# Altium project TE0722.PrjPcb
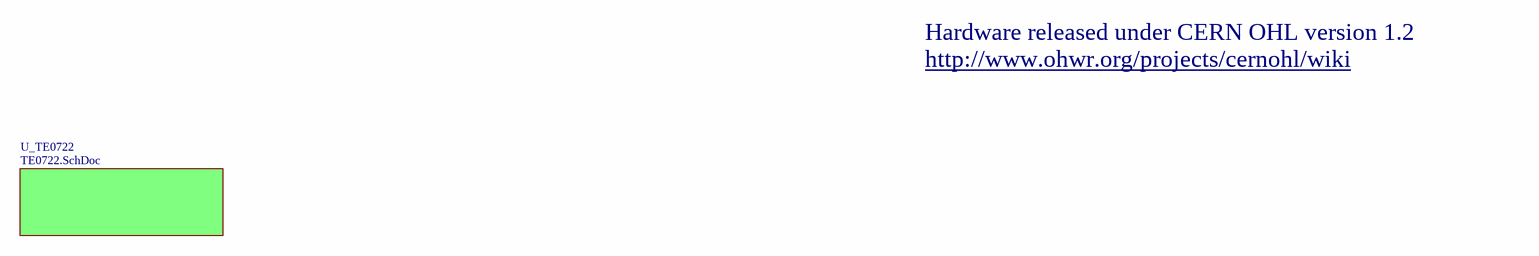
[diagram p0: SoftPropeller_V1_40P14.SchDoc]
7 sheets, 69 parts. Net scope: global (net labels, ports and power ports of the same name join across sheets).
Board file: TE0722.Pcbdoc
Sheets:
  SoftPropeller_V1_40P14.SchDoc
    U_TE0722 = TE0722.SchDoc
      U_POWER = POWER.SchDoc
      U_FPGA_B34 = FPGA_B34.SchDoc
      U_FPGA_B35 = FPGA_B35.SchDoc
      U_FPGA_MIO = FPGA_MIO.SchDoc
      U_FPGA_PWR = FPGA_PWR.SchDoc

## Sheet SoftPropeller_V1_40P14.SchDoc: TE0722
size A4; Organization: Trenz Electronic GmbH; DocumentNumber: 7; Revision: 01; SheetNumber: 7; SheetTotal: 8; Date: 07.11.2014

### Sub-sheets
U_TE0722 = TE0722.SchDoc: no entries

### Notes on the sheet
- Hardware released under CERN OHL version 1.2
- http://www.ohwr.org/projects/cernohl/wiki
- Title:
- Number:
- Rev.
- Date:
- A4
- Copyright:
- Page
- of
- Filename:

## Sheet TE0722.SchDoc: TE0722
size A4; Organization: Trenz Electronic GmbH; DocumentNumber: 8; Revision: 01; SheetNumber: 8; SheetTotal: 8; Date: 07.11.2014
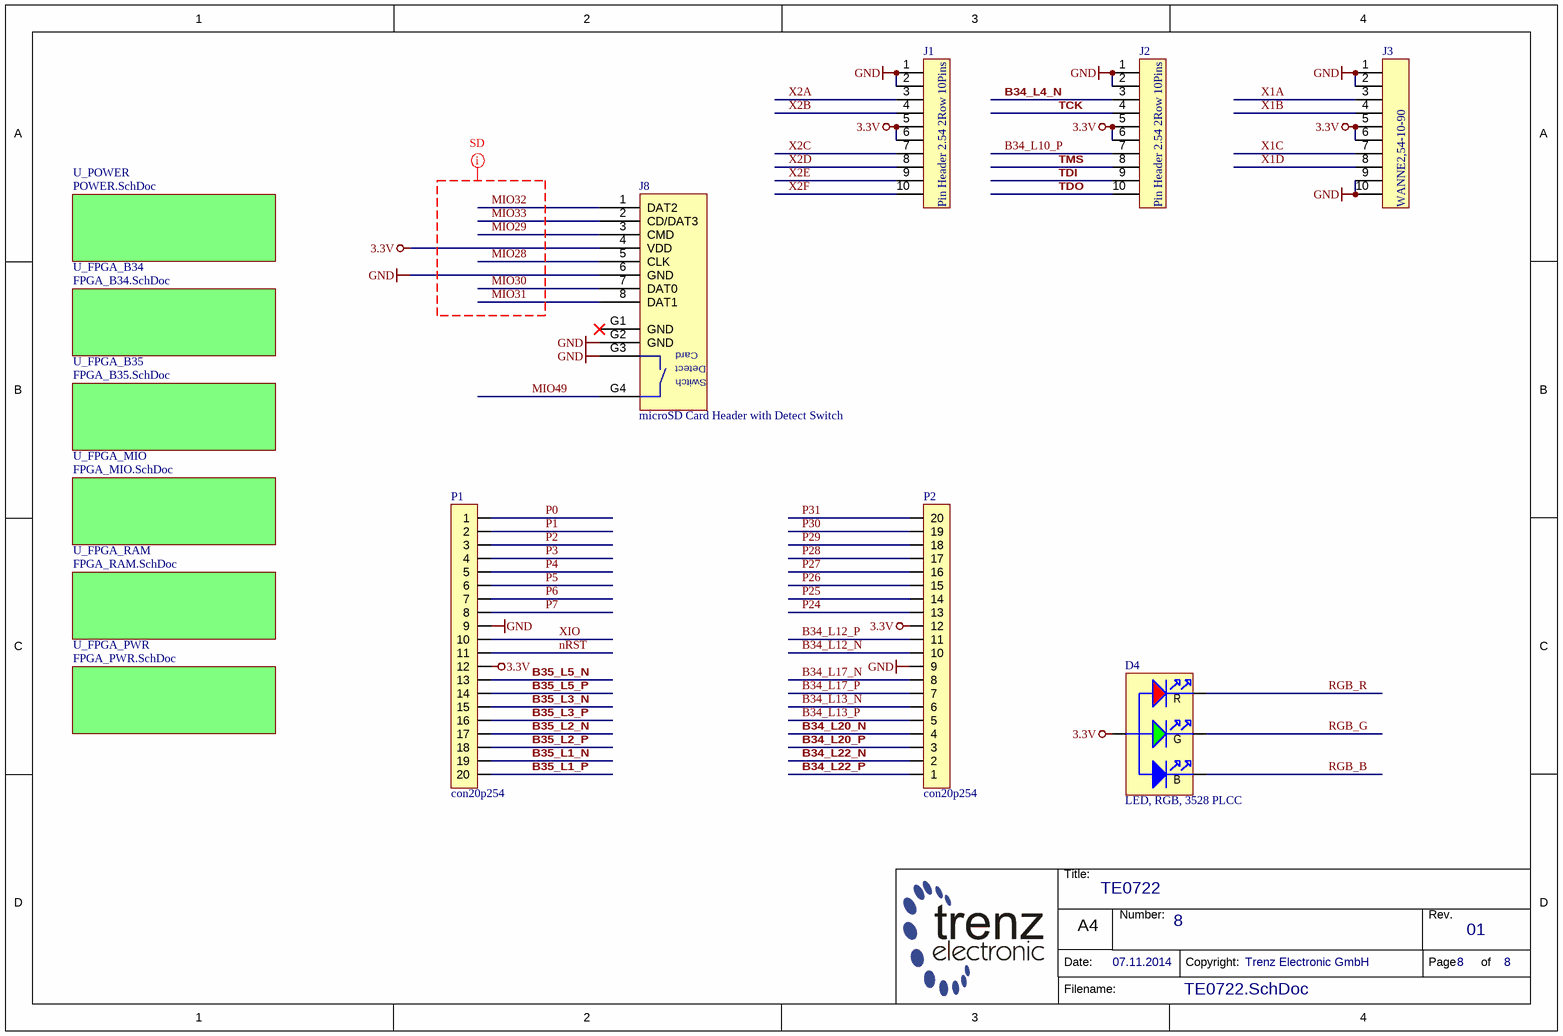
[diagram p1: TE0722.SchDoc]

### Parts
D4  LED, RGB, 3528 PLCC  [PLCC150P360X280X190-4N]
J1  Pin Header 2.54 2Row 10Pins  [STIFTLEISTE2_54 OG 2R-10]
J2  Pin Header 2.54 2Row 10Pins  [STIFTLEISTE2_54 OG 2R-10]
J3  WANNE2,54-10-90  [WANNE2,54-10-90]
J8  microSD Card Header with Detect Switch  [47309-2651]
P1  value con20p254  [con_20p254]  (hidden comment: con_20pin)
P2  value con20p254  [con_20p254]  (hidden comment: con_20pin)

### Sub-sheets
U_FPGA_B34 = FPGA_B34.SchDoc: no entries
U_FPGA_B35 = FPGA_B35.SchDoc: no entries
U_FPGA_MIO = FPGA_MIO.SchDoc: no entries
U_FPGA_PWR = FPGA_PWR.SchDoc: no entries
U_FPGA_RAM = FPGA_RAM.SchDoc (file not in this document): no entries
U_POWER = POWER.SchDoc: no entries

### Nets
3.3V: D4.3(ANODE) J1.5 J1.6 J2.5 J2.6 J3.5 J3.6 J8.4(VDD) P1.12 P2.12
GND: J1.1 J1.2 J2.1 J2.2 J3.1 J3.2 J3.9 J3.10 J8.6(GND) J8.G2(GND) J8.G3(POL) P1.9 P2.9
B34_L4_N: J2.3
B34_L10_P: J2.7
B34_L12_N: P2.10
B34_L12_P: P2.11
B34_L13_N: P2.6
B34_L13_P: P2.5
B34_L17_N: P2.8
B34_L17_P: P2.7
B34_L20_N: P2.4
B34_L20_P: P2.3
B34_L22_N: P2.2
B34_L22_P: P2.1
B35_L1_N: P1.19
B35_L1_P: P1.20
B35_L2_N: P1.17
B35_L2_P: P1.18
B35_L3_N: P1.15
B35_L3_P: P1.16
B35_L5_N: P1.13
B35_L5_P: P1.14
MIO28: J8.5(CLK)
MIO29: J8.3(CMD)
MIO30: J8.7(DAT0)
MIO31: J8.8(DAT1)
MIO32: J8.1(DAT2)
MIO33: J8.2(CD/DAT3)
MIO49: J8.G4(DET)
nRST: P1.11
P0: P1.1
P1: P1.2
P2: P1.3
P3: P1.4
P4: P1.5
P5: P1.6
P6: P1.7
P7: P1.8
P24: P2.13
P25: P2.14
P26: P2.15
P27: P2.16
P28: P2.17
P29: P2.18
P30: P2.19
P31: P2.20
RGB_B: D4.4(BLUE)
RGB_G: D4.2(GREEN)
RGB_R: D4.1(RED)
TCK: J2.4
TDI: J2.9
TDO: J2.10
TMS: J2.8
X1A: J3.3
X1B: J3.4
X1C: J3.7
X1D: J3.8
X2A: J1.3
X2B: J1.4
X2C: J1.7
X2D: J1.8
X2E: J1.9
X2F: J1.10
XIO: P1.10

Not connected (* = marked no-connect by the designer): J8 G1(GND)*

### Layout directives
net class SD: MIO28, MIO29, MIO30, MIO31, MIO32, MIO33

### Notes on the sheet
- Title:
- Number:
- Rev.
- Date:
- A4
- Copyright:
- Page
- of
- Filename:
- (in symbol 24994) Card; Detect; Switch
- (in symbol 26299) R; G; B

### Library data of the parts
D4 = 26299: AN: 26299; Mixed: SMT; Case: 3528 PLCC; HelpURL: B:\AD\adlib\datasheet\Multicomp-LED-RGB-PLCC
J1 J2 = 22402: Stiftleiste gerade 2-reihig, 10pol.; AN: 22402; Mixed: THT; Trenz-Stock: Yes
J3 = 20605: Stiftleiste Wanne 10polig 90°; AN: 20605; Mixed: THT; Trenz-Stock: Yes
J8 = 24994: AN: 24994; Mixed: SMT; Trenz-Stock: Yes; Case: microSD; HelpURL: B:\AD\adlib\datasheet\47309-2651; Preferred: Yes
P1 P2 = con20p254: con_20pin_254_1row; ID: 40; Component: con20p254

## Sheet POWER.SchDoc: TE0722
size A; Date: 07.11.2014; Organization: Trenz Electronic GmbH; DocumentNumber: 1; Revision: 01; SheetNumber: 1; SheetTotal: 8
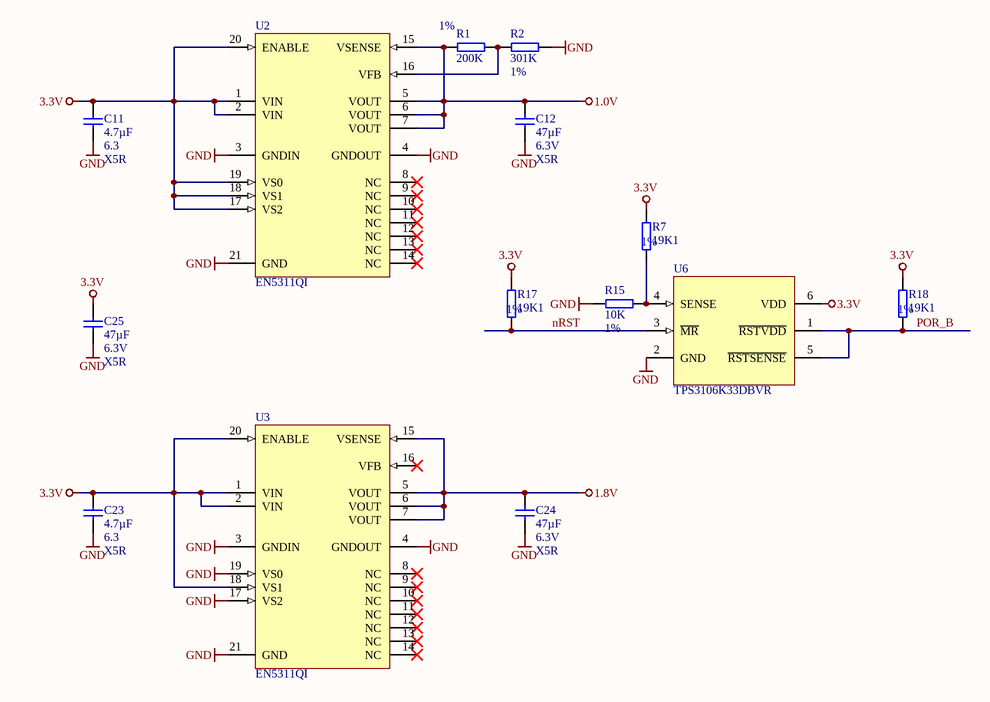
[diagram p2: POWER.SchDoc]

### Parts
C11  4.7µF  Voltage: 6.3  Technology: X5R  [CAPC1005X60N]
C12  47µF  Voltage: 6.3V  Technology: X5R  [CAPC2012X135N]
C23  4.7µF  Voltage: 6.3  Technology: X5R  [CAPC1005X60N]
C24  47µF  Voltage: 6.3V  Technology: X5R  [CAPC2012X135N]
C25  47µF  Voltage: 6.3V  Technology: X5R  [CAPC2012X135N]
R1  200K  Tolerance: 1%  [RESC1005X40N]
R2  301K  Tolerance: 1%  [RESC1005X40N]
R7  19K1  Tolerance: 1%  [RESC0603X26N]
R15  10K  Tolerance: 1%  [RESC0603X26N]
R17  19K1  Tolerance: 1%  [RESC0603X26N]
R18  19K1  Tolerance: 1%  [RESC0603X26N]
U2  EN5311QI  [EN5311QI]
U3  EN5311QI  [EN5311QI]
U6  TPS3106K33DBVR  [SOT95P280X145-6N]

### Nets
1.0V: C12.1 R1.1 U2.5(VOUT) U2.6(VOUT) U2.7(VOUT) U2.15(VSENSE)
1.8V: C24.1 U3.5(VOUT) U3.6(VOUT) U3.7(VOUT) U3.15(VSENSE)
3.3V: C11.1 C23.1 C25.1 R7.2 R17.2 R18.2 U2.1(VIN) U2.2(VIN) U2.17(VS2) U2.18(VS1) U2.19(VS0) U2.20(ENABLE) U3.1(VIN) U3.2(VIN) U3.18(VS1) U3.20(ENABLE) U6.6(VDD)
GND: C11.2 C12.2 C23.2 C24.2 C25.2 R2.2 R15.1 U2.3(GNDIN) U2.4(GNDOUT) U2.21(GND) U3.3(GNDIN) U3.4(GNDOUT) U3.17(VS2) U3.19(VS0) U3.21(GND) U6.2(GND)
nRST: R17.1 U6.3(~{MR})
POR_B: R18.1 U6.1(~{RSTVDD}) U6.5(~{RSTSENSE})
NetR1_2: R1.2 R2.1 U2.16(VFB)
NetR7_1: R7.1 R15.2 U6.4(SENSE)

Not connected (* = marked no-connect by the designer): U2 8(NC)* 9(NC)* 10(NC)* 11(NC)* 12(NC)* 13(NC)* 14(NC)*; U3 8(NC)* 9(NC)* 10(NC)* 11(NC)* 12(NC)* 13(NC)* 14(NC)* 16(VFB)*

### Library data of the parts
C11 C23 = 24719: KON 4.7µF 6.3V X5R SMD 20%; AN: 24719; Mixed: SMT; Value: 4.7u; Preferred: Yes; Case: 1005 (0402); Tolerance: 20%
C12 C24 C25 = 24718: KON 47µF 6,3V  X5R SMD 20%; AN: 24718; Mixed: SMT; Value: 47u; Preferred: Yes; Case: 2012 (0805); Tolerance: 20%
R1 = 23846: WID SMD 200K 1% 0,063W; AN: 23846; Mixed: SMT; Preferred: Yes; Case: 1005 (0402); Value: 200K
R2 = 26224: WID SMD 301K 1% 0,063W; AN: 26224; Mixed: SMT; Case: 1005 (0402); Value: 301k
R7 R17 R18 = 25053: WID SMD 19K1 1% 0,05W; AN: 25053; Mixed: SMT; Value: 19.1K; Case: 0603 (0201); HelpURL: B:\AD\adlib\datasheet\R0201
R15 = 24914: WID SMD 10K 1% 0,05W; AN: 24914; Mixed: SMT; Preferred: Yes; Case: 0603 (0201); Value: 10K; HelpURL: B:\AD\adlib\datasheet\R0201
U2 U3 = 25492: AN: 25492; Mixed: SMT; Trenz-Stock: Yes; Case: QFN20; HelpURL: B:\AD\adlib\datasheet\EN5311QI; Preferred: Yes
U6 = 26439: AN: 26439; Mixed: SMT; Case: SOT23-6; HelpURL: B:\ad\adlib\datasheet\TPS3106

## Sheet FPGA_B34.SchDoc: TE0722
size A4; Organization: Trenz Electronic GmbH; DocumentNumber: 2; Revision: 01; SheetNumber: 2; SheetTotal: 8; Date: 07.11.2014; PageSetup: Record=PageOptions|CenterHorizontal=True|CenterVertical=True|PrintScale=0.96|XCorrection=1.00|YCorrection=1.00|PrintKind=0|BorderSize=5000000|LeftOffset=0|BottomOffset=0|Orientation=2|PaperLength=1000|PaperWidth=1000|Scale=100|PaperSource=7|PrintQuality=-4|MediaType=1|DitherType=10|PaperKind=A4|PrintScaleMode=1
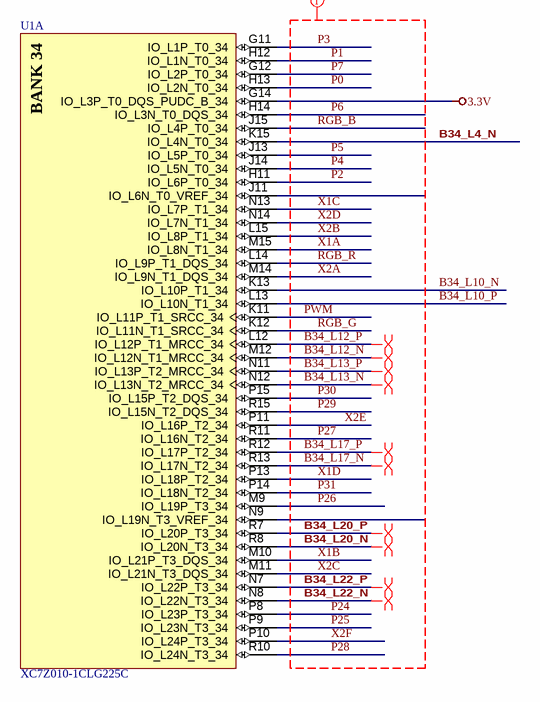
[diagram p3: FPGA_B34.SchDoc]

### Parts
U1  XC7Z010-1CLG225C  [CLG225]  (part A of 8)

### Nets
3.3V: U1.G14(IO_L3P_T0_DQS_PUDC_B_34)
B34_L4_N: U1.K15(IO_L4N_T0_34)
B34_L10_N: U1.K13(IO_L10P_T1_34)
B34_L10_P: U1.L13(IO_L10N_T1_34)
B34_L12_N: U1.M12(IO_L12N_T1_MRCC_34)
B34_L12_P: U1.L12(IO_L12P_T1_MRCC_34)
B34_L13_N: U1.N12(IO_L13N_T2_MRCC_34)
B34_L13_P: U1.N11(IO_L13P_T2_MRCC_34)
B34_L17_N: U1.R13(IO_L17N_T2_34)
B34_L17_P: U1.R12(IO_L17P_T2_34)
B34_L20_N: U1.R8(IO_L20N_T3_34)
B34_L20_P: U1.R7(IO_L20P_T3_34)
B34_L22_N: U1.N8(IO_L22N_T3_34)
B34_L22_P: U1.N7(IO_L22P_T3_34)
P0: U1.H13(IO_L2N_T0_34)
P1: U1.H12(IO_L1N_T0_34)
P2: U1.H11(IO_L6P_T0_34)
P3: U1.G11(IO_L1P_T0_34)
P4: U1.J14(IO_L5N_T0_34)
P5: U1.J13(IO_L5P_T0_34)
P6: U1.H14(IO_L3N_T0_DQS_34)
P7: U1.G12(IO_L2P_T0_34)
P24: U1.P8(IO_L23P_T3_34)
P25: U1.P9(IO_L23N_T3_34)
P26: U1.M9(IO_L19P_T3_34)
P27: U1.R11(IO_L16N_T2_34)
P28: U1.R10(IO_L24N_T3_34)
P29: U1.R15(IO_L15N_T2_DQS_34)
P30: U1.P15(IO_L15P_T2_DQS_34)
P31: U1.P14(IO_L18N_T2_34)
PWM: U1.K11(IO_L11P_T1_SRCC_34)
RGB_B: U1.J15(IO_L4P_T0_34)
RGB_G: U1.K12(IO_L11N_T1_SRCC_34)
RGB_R: U1.L14(IO_L9P_T1_DQS_34)
X1A: U1.M15(IO_L8N_T1_34)
X1B: U1.M10(IO_L21P_T3_DQS_34)
X1C: U1.N13(IO_L7P_T1_34)
X1D: U1.P13(IO_L18P_T2_34)
X2A: U1.M14(IO_L9N_T1_DQS_34)
X2B: U1.L15(IO_L8P_T1_34)
X2C: U1.M11(IO_L21N_T3_DQS_34)
X2D: U1.N14(IO_L7N_T1_34)
X2E: U1.P11(IO_L16P_T2_34)
X2F: U1.P10(IO_L24P_T3_34)

Not connected (* = marked no-connect by the designer): U1 J11(IO_L6N_T0_VREF_34) N9(IO_L19N_T3_VREF_34)

### Layout directives
net class B34: B34_L12_N, B34_L12_P, B34_L13_N, B34_L13_P, B34_L17_N, B34_L17_P, B34_L20_N, B34_L20_P, B34_L22_N, B34_L22_P, P0, P1, P2, P3, P4, P5, P6, P7, P24, P25, P26, P27, P28, P29, P30, P31, PWM, RGB_B, RGB_G, RGB_R, X1A, X1B, X1C, X1D, X2A, X2B, X2C, X2D, X2E, X2F
differential pair: B34_L12_N, B34_L12_P, B34_L13_N, B34_L13_P, B34_L17_N, B34_L17_P, B34_L20_N, B34_L20_P, B34_L22_N, B34_L22_P

### Notes on the sheet
- Title:
- Nummer:
- Rev.
- Datum:
- A4
- Zeichner:
- Blatt
- von
- Filename:
- (in symbol 26308, part A) BANK 34

### Library data of the parts
U1 = 26308: AN: 26308; Mixed: SMT; Case: CLG225; HelpURL: B:\AD\adlib\datasheet\XC7\Zynq

## Sheet FPGA_B35.SchDoc: TE0722
size A4; Organization: Trenz Electronic GmbH; DocumentNumber: 3; Revision: 01; SheetNumber: 3; SheetTotal: 8; Date: 07.11.2014; PageSetup: Record=PageOptions|CenterHorizontal=True|CenterVertical=True|PrintScale=0.96|XCorrection=1.00|YCorrection=1.00|PrintKind=0|BorderSize=5000000|LeftOffset=0|BottomOffset=0|Orientation=2|PaperLength=1000|PaperWidth=1000|Scale=100|PaperSource=7|PrintQuality=-4|MediaType=1|DitherType=10|PaperKind=A4|PrintScaleMode=1
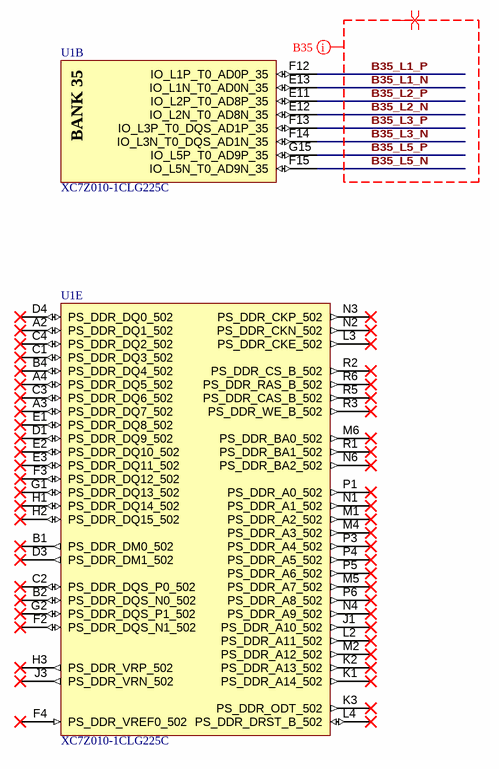
[diagram p4: FPGA_B35.SchDoc]

### Parts
U1  XC7Z010-1CLG225C  [CLG225]  (parts B,E of 8)

### Nets
B35_L1_N: U1.E13(IO_L1N_T0_AD0N_35)
B35_L1_P: U1.F12(IO_L1P_T0_AD0P_35)
B35_L2_N: U1.E12(IO_L2N_T0_AD8N_35)
B35_L2_P: U1.E11(IO_L2P_T0_AD8P_35)
B35_L3_N: U1.F14(IO_L3N_T0_DQS_AD1N_35)
B35_L3_P: U1.F13(IO_L3P_T0_DQS_AD1P_35)
B35_L5_N: U1.F15(IO_L5N_T0_AD9N_35)
B35_L5_P: U1.G15(IO_L5P_T0_AD9P_35)

Not connected (* = marked no-connect by the designer): U1 A2(PS_DDR_DQ1_502)* A3(PS_DDR_DQ7_502)* A4(PS_DDR_DQ5_502)* B1(PS_DDR_DM0_502)* B2(PS_DDR_DQS_N0_502)* B4(PS_DDR_DQ4_502)* C1(PS_DDR_DQ3_502)* C2(PS_DDR_DQS_P0_502)* C3(PS_DDR_DQ6_502)* C4(PS_DDR_DQ2_502)* D1(PS_DDR_DQ9_502)* D3(PS_DDR_DM1_502)* D4(PS_DDR_DQ0_502)* E1(PS_DDR_DQ8_502)* E2(PS_DDR_DQ10_502)* E3(PS_DDR_DQ11_502)* F2(PS_DDR_DQS_N1_502)* F3(PS_DDR_DQ12_502)* F4(PS_DDR_VREF0_502)* G1(PS_DDR_DQ13_502)* G2(PS_DDR_DQS_P1_502)* H1(PS_DDR_DQ14_502)* H2(PS_DDR_DQ15_502)* H3(PS_DDR_VRP_502)* J1(PS_DDR_A10_502)* J3(PS_DDR_VRN_502)* K1(PS_DDR_A14_502)* K2(PS_DDR_A13_502)* K3(PS_DDR_ODT_502)* L2(PS_DDR_A11_502)* L3(PS_DDR_CKE_502)* L4(PS_DDR_DRST_B_502)* M1(PS_DDR_A2_502)* M2(PS_DDR_A12_502)* M4(PS_DDR_A3_502)* M5(PS_DDR_A7_502)* M6(PS_DDR_BA0_502)* N1(PS_DDR_A1_502)* N2(PS_DDR_CKN_502)* N3(PS_DDR_CKP_502)* N4(PS_DDR_A9_502)* N6(PS_DDR_BA2_502)* P1(PS_DDR_A0_502)* P3(PS_DDR_A4_502)* P4(PS_DDR_A5_502)* P5(PS_DDR_A6_502)* P6(PS_DDR_A8_502)* R1(PS_DDR_BA1_502)* R2(PS_DDR_CS_B_502)* R3(PS_DDR_WE_B_502)* R5(PS_DDR_CAS_B_502)* R6(PS_DDR_RAS_B_502)*

### Layout directives
net class B35: B35_L1_N, B35_L1_P, B35_L2_N, B35_L2_P, B35_L3_N, B35_L3_P, B35_L5_N, B35_L5_P
differential pair: B35_L1_N, B35_L1_P, B35_L2_N, B35_L2_P, B35_L3_N, B35_L3_P, B35_L5_N, B35_L5_P

### Notes on the sheet
- Title:
- Nummer:
- Rev.
- Datum:
- A4
- Zeichner:
- Blatt
- von
- Filename:
- (in symbol 26308, part B) BANK 35

### Library data of the parts
U1 = 26308: AN: 26308; Mixed: SMT; Case: CLG225; HelpURL: B:\AD\adlib\datasheet\XC7\Zynq

## Sheet FPGA_MIO.SchDoc: TE0722
size A4; Organization: Trenz Electronic GmbH; DocumentNumber: 4; Revision: 01; SheetNumber: 4; SheetTotal: 8; Date: 07.11.2014; PageSetup: Record=PageOptions|CenterHorizontal=True|CenterVertical=True|PrintScale=0.96|XCorrection=1.00|YCorrection=1.00|PrintKind=0|BorderSize=5000000|LeftOffset=0|BottomOffset=0|Orientation=2|PaperLength=1000|PaperWidth=1000|Scale=100|PaperSource=7|PrintQuality=-4|MediaType=1|DitherType=10|PaperKind=A4|PrintScaleMode=1
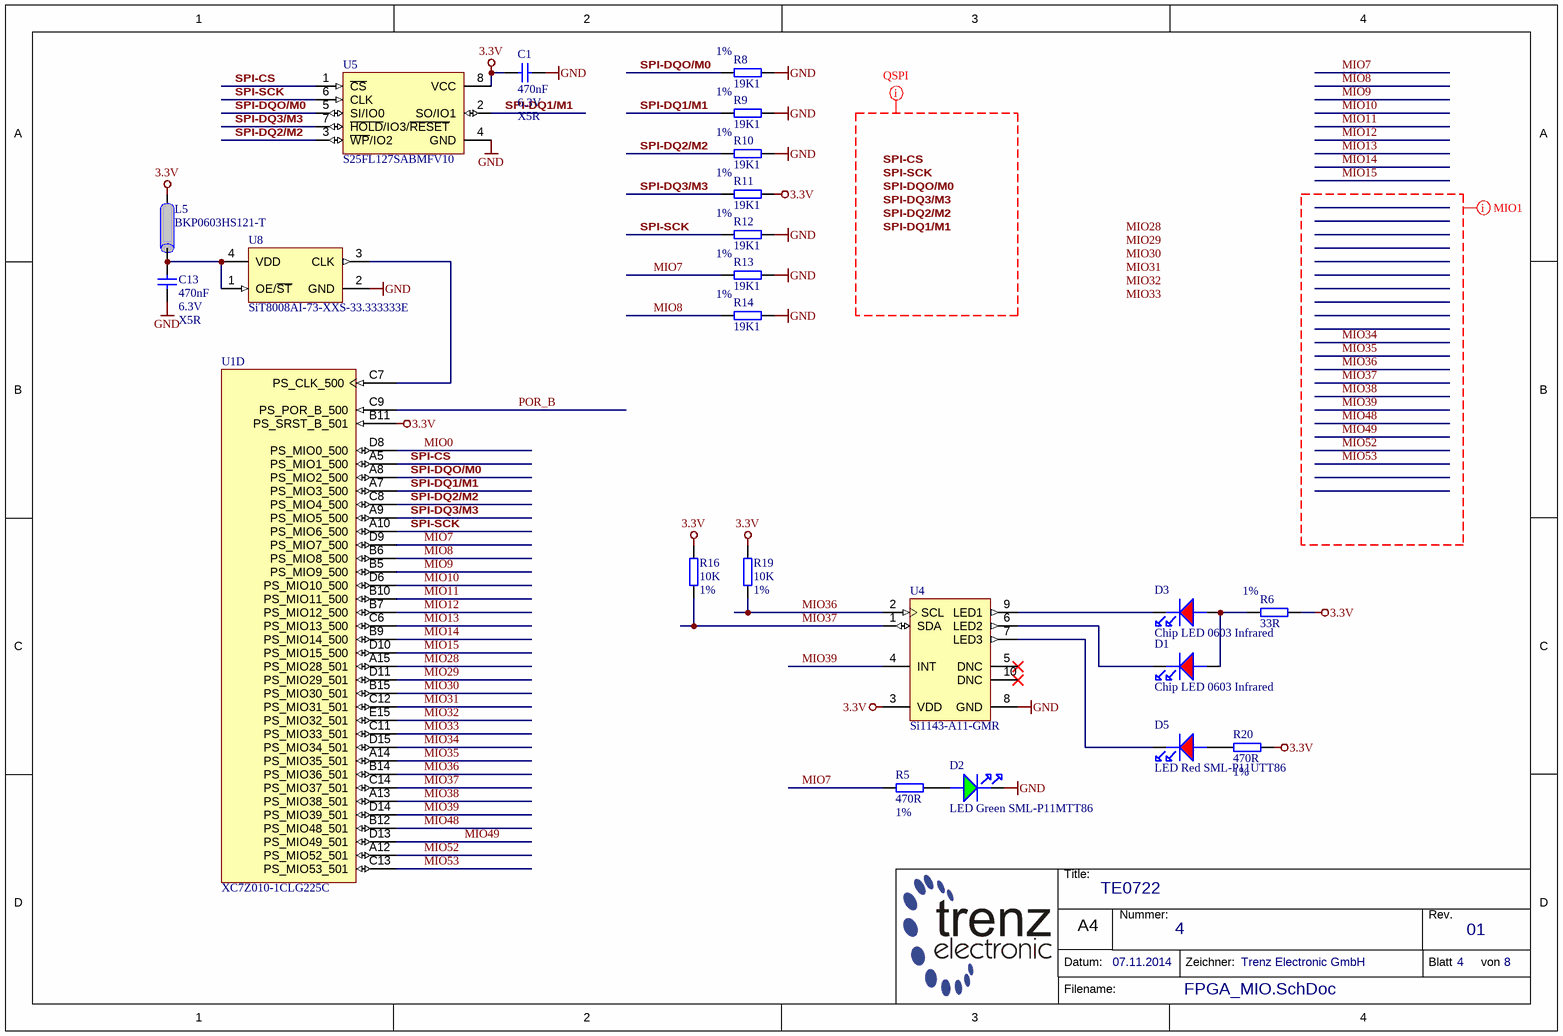
[diagram p5: FPGA_MIO.SchDoc]

### Parts
C1  470nF  Voltage: 6.3V  Technology: X5R  [CAPC0603X33N]
C13  470nF  Voltage: 6.3V  Technology: X5R  [CAPC0603X33N]
D1  Chip LED 0603 Infrared  [chipLED_0603_Red]
D2  LED Green SML-P11MTT86  [LEDC1006X25N_GREEN]
D3  Chip LED 0603 Infrared  [chipLED_0603_Red]
D5  LED Red SML-P11UTT86  [LEDC1006X25N_RED]
L5  BKP0603HS121-T  [INDC0603X33N]
R5  470R  Tolerance: 1%  [RESC1005X40N]
R6  33R  Tolerance: 1%  [RESC1005X40N]
R8  19K1  Tolerance: 1%  [RESC0603X26N]
R9  19K1  Tolerance: 1%  [RESC0603X26N]
R10  19K1  Tolerance: 1%  [RESC0603X26N]
R11  19K1  Tolerance: 1%  [RESC0603X26N]
R12  19K1  Tolerance: 1%  [RESC0603X26N]
R13  19K1  Tolerance: 1%  [RESC0603X26N]
R14  19K1  Tolerance: 1%  [RESC0603X26N]
R16  10K  Tolerance: 1%  [RESC0603X26N]
R19  10K  Tolerance: 1%  [RESC0603X26N]
R20  470R  Tolerance: 1%  [RESC1005X40N]
U1  XC7Z010-1CLG225C  [CLG225]  (part D of 8)
U4  Si1143-A11-GMR  [QFN50P200X200X75-10N]
U5  S25FL127SABMFV10  [SOIC127P790X216-8N]
U8  SiT8008AI-73-XXS-33.333333E  [2016]

### Nets
3.3V: C1.1 L5.1 R6.2 R11.2 R16.2 R19.2 R20.1 U1.B11(PS_SRST_B_501) U4.3(VDD) U5.8(VCC)
GND: C1.2 C13.2 D2.K R8.2 R9.2 R10.2 R12.2 R13.2 R14.2 U4.8(GND) U5.4(GND) U8.2(GND)
MIO0: U1.D8(PS_MIO0_500)
MIO7: R5.2 R13.1 U1.D9(PS_MIO7_500)
MIO8: R14.1 U1.B6(PS_MIO8_500)
MIO9: U1.B5(PS_MIO9_500)
MIO10: U1.D6(PS_MIO10_500)
MIO11: U1.B10(PS_MIO11_500)
MIO12: U1.B7(PS_MIO12_500)
MIO13: U1.C6(PS_MIO13_500)
MIO14: U1.B9(PS_MIO14_500)
MIO15: U1.D10(PS_MIO15_500)
MIO28: U1.A15(PS_MIO28_501)
MIO29: U1.D11(PS_MIO29_501)
MIO30: U1.B15(PS_MIO30_501)
MIO31: U1.C12(PS_MIO31_501)
MIO32: U1.E15(PS_MIO32_501)
MIO33: U1.C11(PS_MIO33_501)
MIO34: U1.D15(PS_MIO34_501)
MIO35: U1.A14(PS_MIO35_501)
MIO36: R19.1 U1.B14(PS_MIO36_501) U4.2(SCL)
MIO37: R16.1 U1.C14(PS_MIO37_501) U4.1(SDA)
MIO38: U1.A13(PS_MIO38_501)
MIO39: U1.D14(PS_MIO39_501) U4.4(INT)
MIO48: U1.B12(PS_MIO48_501)
MIO49: U1.D13(PS_MIO49_501)
MIO52: U1.A12(PS_MIO52_501)
MIO53: U1.C13(PS_MIO53_501)
POR_B: U1.C9(PS_POR_B_500)
SPI-CS: U1.A5(PS_MIO1_500) U5.1(~{CS})
SPI-DQ1/M1: R9.1 U1.A7(PS_MIO3_500) U5.2(SO/IO1)
SPI-DQ2/M2: R10.1 U1.C8(PS_MIO4_500) U5.3(~{WP}/IO2)
SPI-DQ3/M3: R11.1 U1.A9(PS_MIO5_500) U5.7(~{HOLD}/IO3/~{RESET})
SPI-DQO/M0: R8.1 U1.A8(PS_MIO2_500) U5.5(SI/IO0)
SPI-SCK: R12.1 U1.A10(PS_MIO6_500) U5.6(CLK)
NetC13_1: C13.1 L5.2 U8.1(OE/~{ST}) U8.4(VDD)
NetD1_A: D1.A D3.A R6.1
NetD1_K: D1.K U4.6(LED2)
NetD2_A: D2.A R5.1
NetD3_K: D3.K U4.9(LED1)
NetD5_A: D5.A R20.2
NetD5_K: D5.K U4.7(LED3)
NetU1_C7: U1.C7(PS_CLK_500) U8.3(CLK)

Not connected (* = marked no-connect by the designer): U4 5(DNC)* 10(DNC)*

### Layout directives
net class MIO1: MIO34, MIO35, MIO36, MIO37, MIO38, MIO39, MIO48, MIO49, MIO52, MIO53
net class QSPI: SPI-CS, SPI-DQ1/M1, SPI-DQ2/M2, SPI-DQ3/M3, SPI-DQO/M0, SPI-SCK

### Notes on the sheet
- Labels drawn without touching a wire or pin: MIO28, MIO29, MIO30, MIO31, MIO32, MIO33, SPI-CS, SPI-DQ1/M1, SPI-DQ2/M2, SPI-DQ3/M3, SPI-DQO/M0, SPI-SCK
- Title:
- Nummer:
- Rev.
- Datum:
- A4
- Zeichner:
- Blatt
- von
- Filename:

### Library data of the parts
C1 C13 = 24921: KON 470nF X5R 6.3V SMD 20%; AN: 24921; Value: 470n; Mixed: SMT; Preferred: Yes; Case: 0603 (0201); Tolerance: 20%
D1 D3 = 26721: AN: 26721; Voltage: 1.2; Mixed: SMT; Preferred: Yes; Case: 0603; HelpURL: B:\AD\adlib\datasheet\APT1608F3C
D2 = 24211: LED Grün SML-P11MTT86 SMD; AN: 24211; Mixed: SMT; Preferred: Yes; Case: 1005 (0402); HelpURL: B:\AD\adlib\datasheet\SML-P1
D5 = 24212: LED Rot SML-P11UTT86 SMD; AN: 24212; Mixed: SMT; Preferred: Yes; Case: 1005 (0402); HelpURL: B:\AD\adlib\datasheet\SML-P1
L5 = 25393: Ferritdurchführung SMD 0201; AN: 25393; Trenz-Stock: Yes; Mixed: SMT; Tolerance: 25%; Case: 0603 (0201); HelpURL: B:\AD\adlib\datasheet\MULTILAYER CHIP BEAD INDUCTORS BK; Preferred: Yes
R5 R20 = 22769: WID SMD 470R 1% 0,063W; AN: 22769; Value: 470; Mixed: SMT; Preferred: Yes; Case: 1005 (0402)
R6 = 22770: WID SMD 33R 1% 0,063W; AN: 22770; Mixed: SMT; Value: 33; Preferred: Yes; Case: 1005 (0402)
R8-R14 = 25053: as R7 on sheet POWER; Case: 0603 (0201); HelpURL: B:\AD\adlib\datasheet\R0201
R16 R19 = 24914: as R15 on sheet POWER; Case: 0603 (0201); Value: 10K; HelpURL: B:\AD\adlib\datasheet\R0201
U1 = 26308: AN: 26308; Mixed: SMT; Case: CLG225; HelpURL: B:\AD\adlib\datasheet\XC7\Zynq
U4 = 26318: AN: 26318; Mixed: AMT; Case: QFN10; HelpURL: B:\AD\adlib\datasheet\Si1141x
U5 = 26078: S25FL127SABMFV10 automotive SO8; AN: 26078; Mixed: SMT; Case: SO8W; HelpURL: B:\AD\adlib\datasheet\S25FL12xS
U8 = 25023: SiT8008AI-73-XXS-33.333333E MEMS Oszillator 33.333333MHz; AN: 25023; Value: 33M; Trenz-Stock: Yes; Mixed: SMT; Case: 2.0  x 1.6mm; HelpURL: B:\AD\adlib\datasheet\SiT8008; Preferred: Yes

## Sheet FPGA_PWR.SchDoc: TE0722
size A4; Organization: Trenz Electronic GmbH; DocumentNumber: 6; Revision: 01; SheetNumber: 6; SheetTotal: 8; Date: 07.11.2014; PageSetup: Record=PageOptions|CenterHorizontal=True|CenterVertical=True|PrintScale=0.96|XCorrection=1.00|YCorrection=1.00|PrintKind=0|BorderSize=5000000|LeftOffset=0|BottomOffset=0|Orientation=2|PaperLength=1000|PaperWidth=1000|Scale=100|PaperSource=7|PrintQuality=-4|MediaType=1|DitherType=10|PaperKind=A4|PrintScaleMode=1
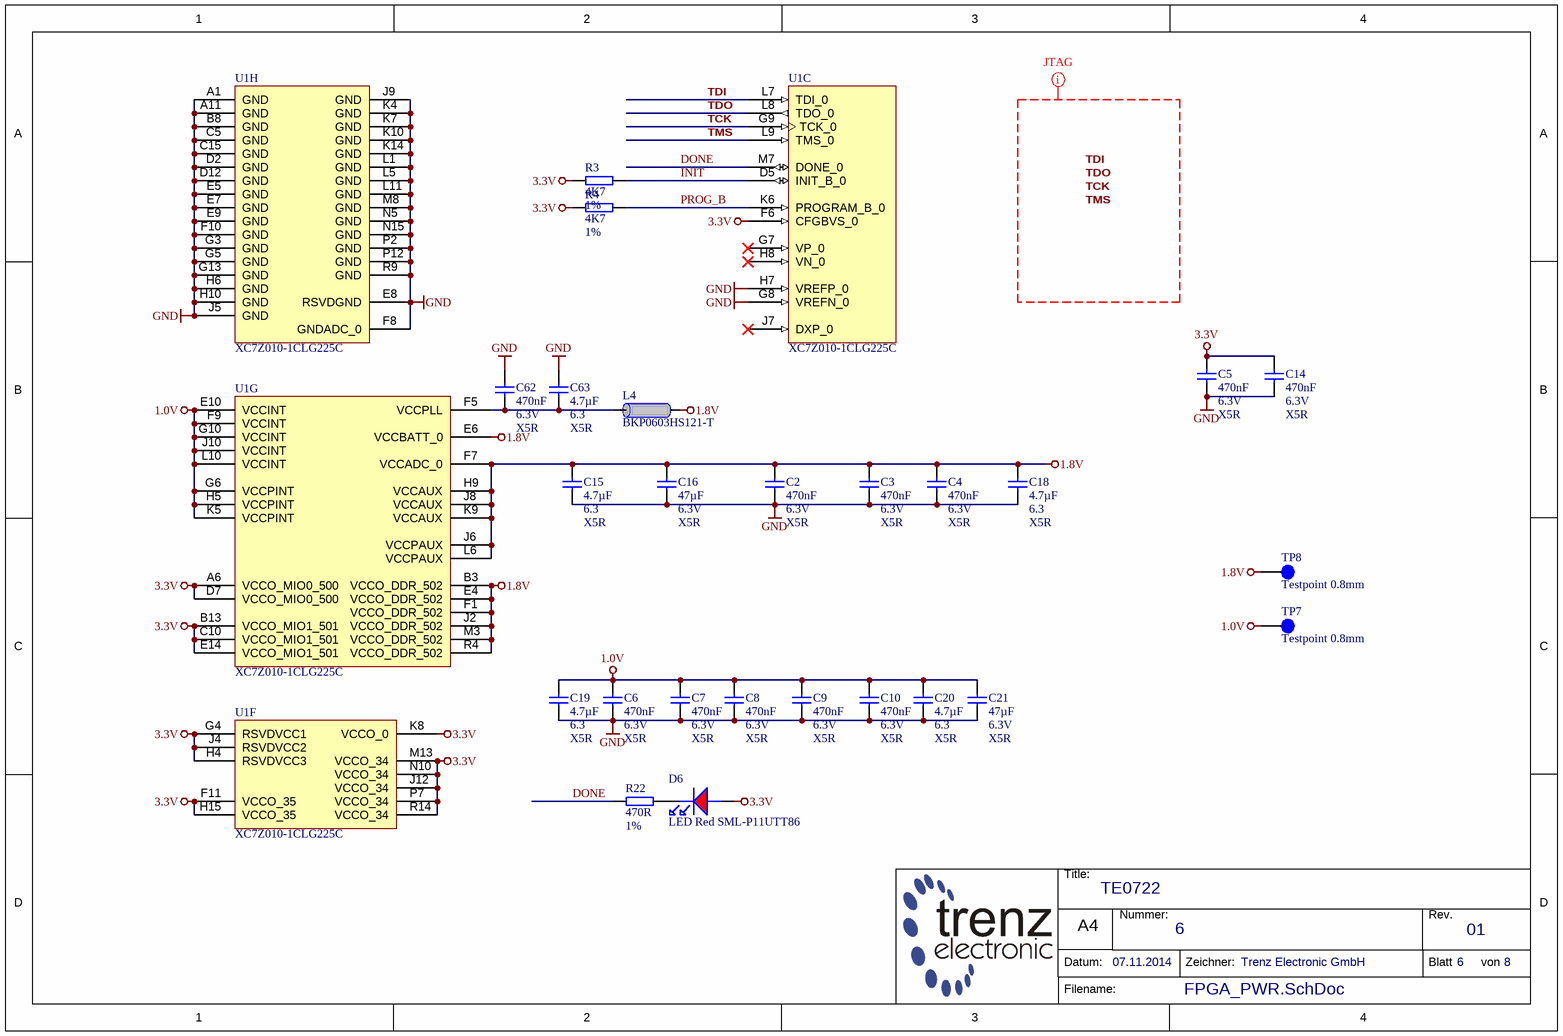
[diagram p6: FPGA_PWR.SchDoc]

### Parts
C2  470nF  Voltage: 6.3V  Technology: X5R  [CAPC0603X33N]
C3  470nF  Voltage: 6.3V  Technology: X5R  [CAPC0603X33N]
C4  470nF  Voltage: 6.3V  Technology: X5R  [CAPC0603X33N]
C5  470nF  Voltage: 6.3V  Technology: X5R  [CAPC0603X33N]
C6  470nF  Voltage: 6.3V  Technology: X5R  [CAPC0603X33N]
C7  470nF  Voltage: 6.3V  Technology: X5R  [CAPC0603X33N]
C8  470nF  Voltage: 6.3V  Technology: X5R  [CAPC0603X33N]
C9  470nF  Voltage: 6.3V  Technology: X5R  [CAPC0603X33N]
C10  470nF  Voltage: 6.3V  Technology: X5R  [CAPC0603X33N]
C14  470nF  Voltage: 6.3V  Technology: X5R  [CAPC0603X33N]
C15  4.7µF  Voltage: 6.3  Technology: X5R  [CAPC1005X60N]
C16  47µF  Voltage: 6.3V  Technology: X5R  [CAPC2012X135N]
C18  4.7µF  Voltage: 6.3  Technology: X5R  [CAPC1005X60N]
C19  4.7µF  Voltage: 6.3  Technology: X5R  [CAPC1005X60N]
C20  4.7µF  Voltage: 6.3  Technology: X5R  [CAPC1005X60N]
C21  47µF  Voltage: 6.3V  Technology: X5R  [CAPC2012X135N]
C62  470nF  Voltage: 6.3V  Technology: X5R  [CAPC0603X33N]
C63  4.7µF  Voltage: 6.3  Technology: X5R  [CAPC1005X60N]
D6  LED Red SML-P11UTT86  [LEDC1006X25N_RED]
L4  BKP0603HS121-T  [INDC0603X33N]
R3  4K7  Tolerance: 1%  [RESC0603X26N]
R4  4K7  Tolerance: 1%  [RESC0603X26N]
R22  470R  Tolerance: 1%  [RESC1005X40N]
TP7  Testpoint 0.8mm  [TP_0.8mm]
TP8  Testpoint 0.8mm  [TP_0.8mm]
U1  XC7Z010-1CLG225C  [CLG225]  (parts C,F,G,H of 8)

### Nets
1.0V: C6.2 C7.2 C8.2 C9.2 C10.2 C19.1 C20.1 C21.1 TP7.1 U1.E10(VCCINT) U1.F9(VCCINT) U1.G6(VCCPINT) U1.G10(VCCINT) U1.H5(VCCPINT) U1.J10(VCCINT) U1.K5(VCCPINT) U1.L10(VCCINT)
1.8V: C2.2 C3.1 C4.2 C15.1 C16.1 C18.1 L4.1 TP8.1 U1.B3(VCCO_DDR_502) U1.E4(VCCO_DDR_502) U1.E6(VCCBATT_0) U1.F1(VCCO_DDR_502) U1.F7(VCCADC_0) U1.H9(VCCAUX) U1.J2(VCCO_DDR_502) U1.J6(VCCPAUX) U1.J8(VCCAUX) U1.K9(VCCAUX) U1.L6(VCCPAUX) U1.M3(VCCO_DDR_502) U1.R4(VCCO_DDR_502)
3.3V: C5.2 C14.2 D6.A R3.2 R4.2 U1.A6(VCCO_MIO0_500) U1.B13(VCCO_MIO1_501) U1.C10(VCCO_MIO1_501) U1.D7(VCCO_MIO0_500) U1.E14(VCCO_MIO1_501) U1.F6(CFGBVS_0) U1.F11(VCCO_35) U1.G4(RSVDVCC1) U1.H4(RSVDVCC3) U1.H15(VCCO_35) U1.J4(RSVDVCC2) U1.J12(VCCO_34) U1.K8(VCCO_0) U1.M13(VCCO_34) U1.N10(VCCO_34) U1.P7(VCCO_34) U1.R14(VCCO_34)
GND: C2.1 C3.2 C4.1 C5.1 C6.1 C7.1 C8.1 C9.1 C10.1 C14.1 C15.2 C16.2 C18.2 C19.2 C20.2 C21.2 C62.1 C63.1 U1.A1(GND) U1.A11(GND) U1.B8(GND) U1.C5(GND) U1.C15(GND) U1.D2(GND) U1.D12(GND) U1.E5(GND) U1.E7(GND) U1.E8(RSVDGND) U1.E9(GND) U1.F8(GNDADC_0) U1.F10(GND) U1.G3(GND) U1.G5(GND) U1.G8(VREFN_0) U1.G13(GND) U1.H6(GND) U1.H7(VREFP_0) U1.H10(GND) U1.J5(GND) U1.J9(GND) U1.K4(GND) U1.K7(GND) U1.K10(GND) U1.K14(GND) U1.L1(GND) U1.L5(GND) U1.L11(GND) U1.M8(GND) U1.N5(GND) U1.N15(GND) U1.P2(GND) U1.P12(GND) U1.R9(GND)
DONE: R22.2 U1.M7(DONE_0)
INIT: R3.1 U1.D5(INIT_B_0)
PROG_B: R4.1 U1.K6(PROGRAM_B_0)
TCK: U1.G9(TCK_0)
TDI: U1.L7(TDI_0)
TDO: U1.L8(TDO_0)
TMS: U1.L9(TMS_0)
NetC62_2: C62.2 C63.2 L4.2 U1.F5(VCCPLL)
NetD6_K: D6.K R22.1

Not connected (* = marked no-connect by the designer): U1 G7(VP_0)* H8(VN_0)* J7(DXP_0)*

### Layout directives
net class JTAG: TCK, TDI, TDO, TMS

### Notes on the sheet
- Labels drawn without touching a wire or pin: TCK, TDI, TDO, TMS
- Title:
- Nummer:
- Rev.
- Datum:
- A4
- Zeichner:
- Blatt
- von
- Filename:

### Library data of the parts
C2-C10 C14 = 24921: as C1 on sheet FPGA_MIO; Case: 0603 (0201); Tolerance: 20%
C15 C18-C20 C63 = 24719: as C11 on sheet POWER; Case: 1005 (0402); Tolerance: 20%
C16 C21 = 24718: as C12 on sheet POWER; Case: 2012 (0805); Tolerance: 20%
C62 = 24921: KON 470nF X5R 6.3V SMD 20%; AN: 24921; Mixed: SMT; Value: 470n; Preferred: Yes; Case: 0603 (0201); Tolerance: 20%
D6 = 24212: as D5 on sheet FPGA_MIO; Case: 1005 (0402); HelpURL: B:\AD\adlib\datasheet\SML-P1
L4 = 25393: as L5 on sheet FPGA_MIO; Case: 0603 (0201); HelpURL: B:\AD\adlib\datasheet\MULTILAYER CHIP BEAD INDUCTORS BK; Preferred: Yes
R3 R4 = 25242: WID SMD 4K7 1% 0,05W; AN: 25242; Value: 4.7K; Mixed: SMT; Preferred: Yes; Case: 0603 (0201); HelpURL: B:\AD\adlib\datasheet\R0201
R22 = 22769: as R5 on sheet FPGA_MIO; Case: 1005 (0402)
TP7 TP8 = 26289: AN: 26289; Mixed: 1
U1 = 26308: AN: 26308; Mixed: SMT; Case: CLG225; HelpURL: B:\AD\adlib\datasheet\XC7\Zynq

## Nets that join several sheets
1.0V: POWER (6 pins), FPGA_PWR (17 pins)
1.8V: POWER (5 pins), FPGA_PWR (21 pins)
3.3V: TE0722 (10 pins), POWER (17 pins), FPGA_B34 (U1.G14), FPGA_MIO (10 pins), FPGA_PWR (22 pins)
GND: TE0722 (13 pins), POWER (16 pins), FPGA_MIO (12 pins), FPGA_PWR (53 pins)
B34_L4_N: TE0722 (J2.3), FPGA_B34 (U1.K15)
B34_L10_P: TE0722 (J2.7), FPGA_B34 (U1.L13)
B34_L12_N: TE0722 (P2.10), FPGA_B34 (U1.M12)
B34_L12_P: TE0722 (P2.11), FPGA_B34 (U1.L12)
B34_L13_N: TE0722 (P2.6), FPGA_B34 (U1.N12)
B34_L13_P: TE0722 (P2.5), FPGA_B34 (U1.N11)
B34_L17_N: TE0722 (P2.8), FPGA_B34 (U1.R13)
B34_L17_P: TE0722 (P2.7), FPGA_B34 (U1.R12)
B34_L20_N: TE0722 (P2.4), FPGA_B34 (U1.R8)
B34_L20_P: TE0722 (P2.3), FPGA_B34 (U1.R7)
B34_L22_N: TE0722 (P2.2), FPGA_B34 (U1.N8)
B34_L22_P: TE0722 (P2.1), FPGA_B34 (U1.N7)
B35_L1_N: TE0722 (P1.19), FPGA_B35 (U1.E13)
B35_L1_P: TE0722 (P1.20), FPGA_B35 (U1.F12)
B35_L2_N: TE0722 (P1.17), FPGA_B35 (U1.E12)
B35_L2_P: TE0722 (P1.18), FPGA_B35 (U1.E11)
B35_L3_N: TE0722 (P1.15), FPGA_B35 (U1.F14)
B35_L3_P: TE0722 (P1.16), FPGA_B35 (U1.F13)
B35_L5_N: TE0722 (P1.13), FPGA_B35 (U1.F15)
B35_L5_P: TE0722 (P1.14), FPGA_B35 (U1.G15)
MIO28: TE0722 (J8.5), FPGA_MIO (U1.A15)
MIO29: TE0722 (J8.3), FPGA_MIO (U1.D11)
MIO30: TE0722 (J8.7), FPGA_MIO (U1.B15)
MIO31: TE0722 (J8.8), FPGA_MIO (U1.C12)
MIO32: TE0722 (J8.1), FPGA_MIO (U1.E15)
MIO33: TE0722 (J8.2), FPGA_MIO (U1.C11)
MIO49: TE0722 (J8.G4), FPGA_MIO (U1.D13)
nRST: TE0722 (P1.11), POWER (R17.1 U6.3)
P0: TE0722 (P1.1), FPGA_B34 (U1.H13)
P1: TE0722 (P1.2), FPGA_B34 (U1.H12)
P2: TE0722 (P1.3), FPGA_B34 (U1.H11)
P3: TE0722 (P1.4), FPGA_B34 (U1.G11)
P4: TE0722 (P1.5), FPGA_B34 (U1.J14)
P5: TE0722 (P1.6), FPGA_B34 (U1.J13)
P6: TE0722 (P1.7), FPGA_B34 (U1.H14)
P7: TE0722 (P1.8), FPGA_B34 (U1.G12)
P24: TE0722 (P2.13), FPGA_B34 (U1.P8)
P25: TE0722 (P2.14), FPGA_B34 (U1.P9)
P26: TE0722 (P2.15), FPGA_B34 (U1.M9)
P27: TE0722 (P2.16), FPGA_B34 (U1.R11)
P28: TE0722 (P2.17), FPGA_B34 (U1.R10)
P29: TE0722 (P2.18), FPGA_B34 (U1.R15)
P30: TE0722 (P2.19), FPGA_B34 (U1.P15)
P31: TE0722 (P2.20), FPGA_B34 (U1.P14)
POR_B: POWER (R18.1 U6.1 U6.5), FPGA_MIO (U1.C9)
RGB_B: TE0722 (D4.4), FPGA_B34 (U1.J15)
RGB_G: TE0722 (D4.2), FPGA_B34 (U1.K12)
RGB_R: TE0722 (D4.1), FPGA_B34 (U1.L14)
TCK: TE0722 (J2.4), FPGA_PWR (U1.G9)
TDI: TE0722 (J2.9), FPGA_PWR (U1.L7)
TDO: TE0722 (J2.10), FPGA_PWR (U1.L8)
TMS: TE0722 (J2.8), FPGA_PWR (U1.L9)
X1A: TE0722 (J3.3), FPGA_B34 (U1.M15)
X1B: TE0722 (J3.4), FPGA_B34 (U1.M10)
X1C: TE0722 (J3.7), FPGA_B34 (U1.N13)
X1D: TE0722 (J3.8), FPGA_B34 (U1.P13)
X2A: TE0722 (J1.3), FPGA_B34 (U1.M14)
X2B: TE0722 (J1.4), FPGA_B34 (U1.L15)
X2C: TE0722 (J1.7), FPGA_B34 (U1.M11)
X2D: TE0722 (J1.8), FPGA_B34 (U1.N14)
X2E: TE0722 (J1.9), FPGA_B34 (U1.P11)
X2F: TE0722 (J1.10), FPGA_B34 (U1.P10)

## Assembly variants
TE0722-01-FULL: not fitted J1 J2 J3 P1 P2
TE0722-01-LC: not fitted D1 D3 D4 D5 J1 J2 J3 J8 P1 P2 R6 R16 R19 R20 U4